# EAGLE design light (EAGLE 8.7.0)
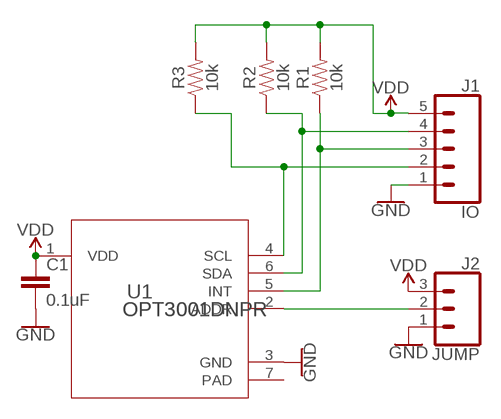
[diagram p0: schematic, sheet 1]

## Parts
C1  0.1uF  0.1UF-KIT-EZ-50V-20%  [CAP-PTH-SMALL-KIT]
J1  IO  CONN_05  [1X05]
J2  JUMP  CONN_03  [1X03]
R1  10k  10KOHM-HORIZ-1/4W-5%  [AXIAL-0.3]
R2  10k  10KOHM-HORIZ-1/4W-5%  [AXIAL-0.3]
R3  10k  10KOHM-HORIZ-1/4W-5%  [AXIAL-0.3]
U1  OPT3001DNPR  [DNP0006A]

## Nets
ADD: J2.2 U1.2(ADDR)
GND: C1.2 J1.1 J2.1 U1.3(GND)
INT: J1.3 R1.P$1 U1.5(INT)
SCL: J1.2 R3.P$1 U1.4(SCL)
SDA: J1.4 R2.P$1 U1.6(SDA)
VDD: C1.1 J1.5 J2.3 R1.P$2 R2.P$2 R3.P$2 U1.1(VDD)
Unconnected: U1.7(PAD)

## Library data of the parts
C1 = SparkFun-Capacitors:0.1UF: 0.1µF ceramic capacitors A capacitor is a passive two-terminal electrical component used to store electrical energy temporarily in an electric field.; PROD_ID: CAP-08370
J1 = SparkFun-Connectors:CONN_05: Multi connection point. Often used as Generic Header-pin footprint for 0.1 inch spaced/style header connections On any of the 0.1 inch spaced packages, you can populate with these: Break Away Headers - Straight <https://www.sparkfun.com/products/116> (PRT-00116) Break Away Male Headers - Right Angle <https://www.sparkfun.com/products/553> (PRT-00553) Female Headers <https://www.sparkfun.com/products/115> (PRT-00115) Break Away Headers - Machine Pin <https://www.sparkfun.com/products/117> (PRT-00117) Break Away Female Headers - Swiss Machine Pin <https://www.sparkfun.com/products/743> (PRT-00743) For SCREWTERMINALS and SPRING TERMINALS visit here: Screw Terimnals on SparkFun.com <https://www.sparkfun.com/search/results?term=Screw+Terminals> (5mm/3.5mm/2.54mm spacing) This device is also useful as a general connection point to wire up your design to another part of your project. Our various solder wires solder well into these plated through hole pads. Hook-Up Wire - Assortment (Stranded, 22 AWG) <https://www.sparkfun.com/products/11375> (PRT-11375) Hook-Up Wire - Assortment (Solid Core, 22 AWG) <https://www.sparkfun.com/products/11367> (PRT-11367) View the entire wire category on our website here <https://www.sparkfun.com/categories/141> Special notes: Molex polarized connector foot print use with SKU : PRT-08231 with associated crimp pins and housings. 1MM SMD Version SKU: PRT-10208
J2 = SparkFun-Connectors:CONN_03: Multi connection point. Often used as Generic Header-pin footprint for 0.1 inch spaced/style header connections On any of the 0.1 inch spaced packages, you can populate with these: Break Away Headers - Straight <https://www.sparkfun.com/products/116> (PRT-00116) Break Away Male Headers - Right Angle <https://www.sparkfun.com/products/553> (PRT-00553) Female Headers <https://www.sparkfun.com/products/115> (PRT-00115) Break Away Headers - Machine Pin <https://www.sparkfun.com/products/117> (PRT-00117) Break Away Female Headers - Swiss Machine Pin <https://www.sparkfun.com/products/743> (PRT-00743) Stackable Header - 3 Pin (Female, 0.1") <https://www.sparkfun.com/products/13875> (PRT-13875) For SCREWTERMINALS and SPRING TERMINALS visit here: Screw Terimnals on SparkFun.com <https://www.sparkfun.com/search/results?term=Screw+Terminals> (5mm/3.5mm/2.54mm spacing) This device is also useful as a general connection point to wire up your design to another part of your project. Our various solder wires solder well into these plated through hole pads. Hook-Up Wire - Assortment (Stranded, 22 AWG) <https://www.sparkfun.com/products/11375> (PRT-11375) Hook-Up Wire - Assortment (Solid Core, 22 AWG) <https://www.sparkfun.com/products/11367> (PRT-11367) View the entire wire category on our website here <https://www.sparkfun.com/categories/141> Special notes: Molex polarized connector foot print use with SKU : PRT-08232 with associated crimp pins and housings.
R1-R3 = SparkFun-Resistors:10KOHM: 10kΩ resistor A resistor is a passive two-terminal electrical component that implements electrical resistance as a circuit element. Resistors act to reduce current flow, and, at the same time, act to lower voltage levels within circuits. - Wikipedia; PROD_ID: RES-09435
U1 = OPT3001DNPT:OPT3001DNPR: OPT3001DNPT

## Board
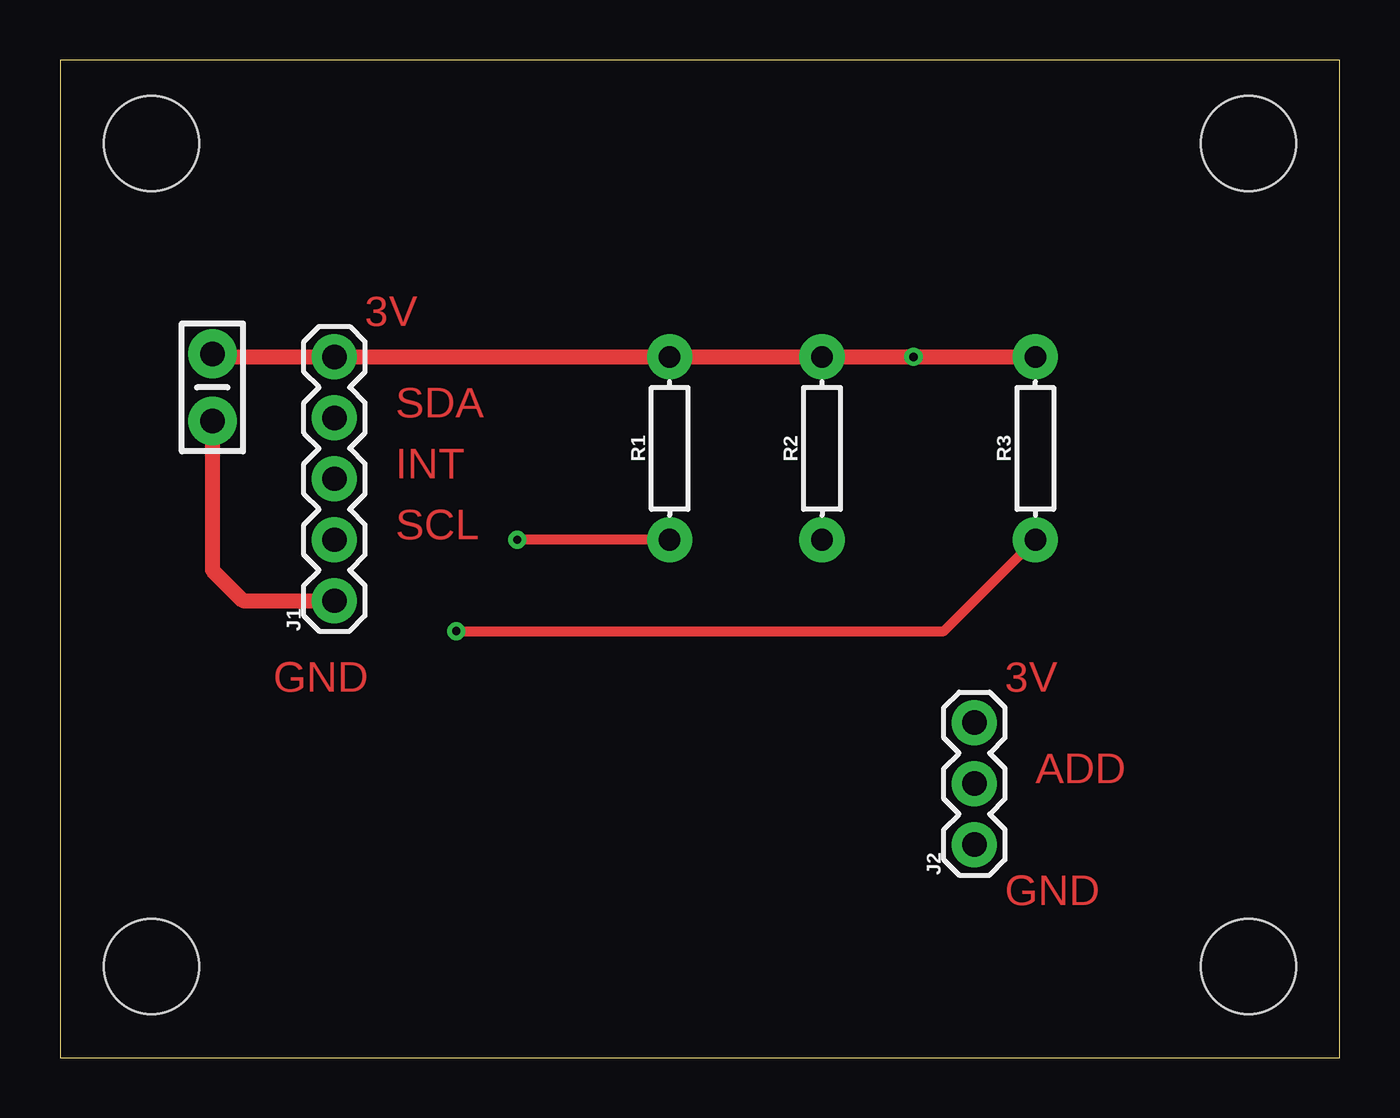
[diagram p1: board, top side]
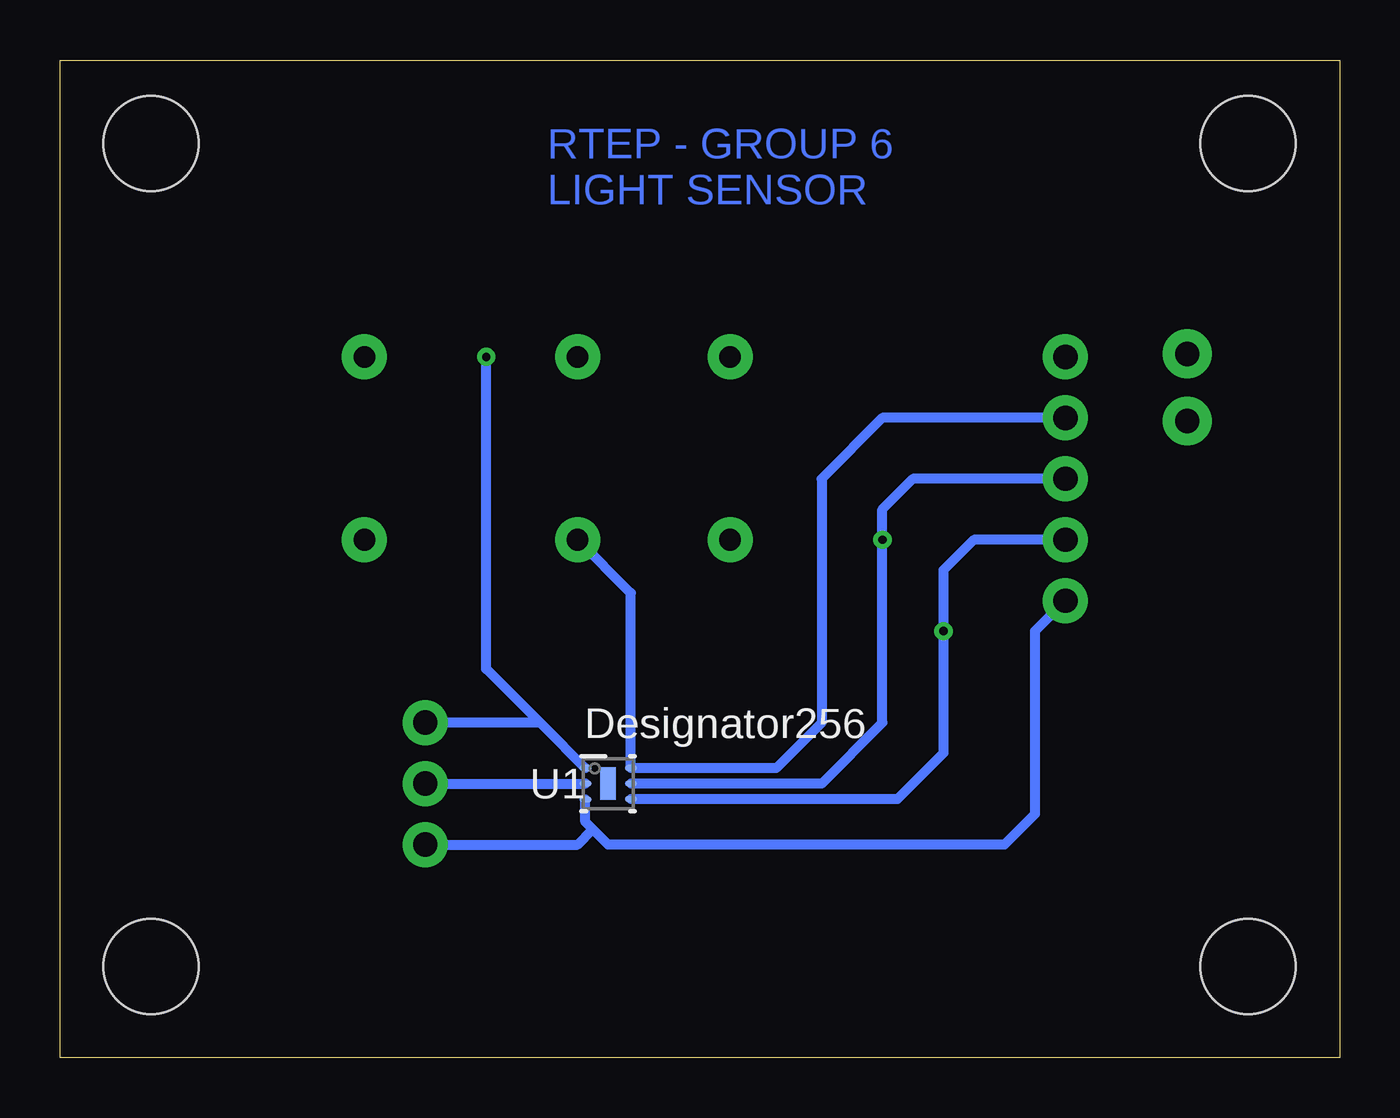
[diagram p2: board, bottom side, seen from below]

Size 53.32 x 41.58 mm. Coordinates in mm from the lower left corner, seen from the top.
Outline: 0,0 53.32,0 53.32,41.58 0,41.58 0,0
Copper layers (1*16): Top 0.035mm / dielectric 1.5mm / Bottom 0.035mm
Design rules "default *": minimum track width 6mil, minimum drill 0.35mm, track to track 6mil, track to pad 6mil, pad to pad 6mil, via to via 6mil, smd to smd 6mil, copper to edge 40mil, drill to drill 6mil, minimum pad ring 10mil, minimum via ring 8mil, stop-mask expansion 4mil, vias tented up to drill 0mil, thermal gap 10mil
Holes 3.96 mm at 3.81,38.1 49.53,38.1 49.53,3.81 3.81,3.81

### Footprints (pad centres in the part's own frame; a part is rotated, then mirrored left to right if it is on the bottom)
CAP-PTH-SMALL-KIT = drill 1.016 pad 2.032: 1 -1.397,0; 2 1.397,0
1X05 = drill 1.016 pad 1.88: 1 0,0; 2 2.54,0; 3 5.08,0; 4 7.62,0; 5 10.16,0
1X03 = drill 1.016 pad 1.88: 1 0,0; 2 2.54,0; 3 5.08,0
AXIAL-0.3 = drill 0.9 pad 1.88: P$1 -3.81,0; P$2 3.81,0
DNP0006A = smd 0.5 x 0.25: 1 -0.95,0.65; 2 -0.95,0; 3 -0.95,-0.655; 4 0.95,-0.65; 5 0.95,0; 6 0.95,0.65 | smd 0.65 x 1.35: 7 0,0

### Placement (x,y rotation side)
C1  6.35,27.94 270 top
J1  11.43,19.05 90 top
J2  38.1,8.89 90 top
R1  25.4,25.4 90 top
R2  31.75,25.4 90 top
R3  40.64,25.4 90 top
U1  30.48,11.43 0 bottom

### Tracks (layer width: path | path; a pad name or v marks a point on that pad's centre or on a via)
ADD
  Bottom 0.406: J2.2 U1.2
GND
  Top 0.635: J1.1 7.62,19.05 6.35,20.32 C1.2
  Bottom 0.406: J1.1 12.7,17.78 12.7,10.16 13.97,8.89 30.48,8.89 31.12,9.53 | 31.12,9.53 31.43,9.84 U1.3 | J2.1 31.75,8.89 31.12,9.53
INT  (via drill 0.35)
  Top 0.406: R1.P$1 v19.05,21.59
  Bottom 0.406: J1.3 17.78,24.13 19.05,22.86 v19.05,21.59 19.05,13.97 21.59,11.43 U1.5
SCL  (via drill 0.35)
  Top 0.406: v16.51,17.78 36.83,17.78 R3.P$1
  Bottom 0.406: J1.2 15.24,21.59 16.51,20.32 v16.51,17.78 16.51,12.7 18.43,10.78 U1.4
SDA
  Bottom 0.406: J1.4 19.05,26.67 21.59,24.13 21.59,13.97 23.48,12.08 U1.6 29.53,19.37 R2.P$1
VDD  (via drill 0.35)
  Top 0.635: C1.1 6.48,29.21 J1.5 R1.P$2 R2.P$2 v35.56,29.21 R3.P$2
  Bottom 0.406: v35.56,29.21 35.56,16.21 33.32,13.97 | U1.1 33.17,13.82 33.32,13.97 | 33.32,13.97 J2.3

### Text on the board
Top: 3V | SDA | INT | SCL | GND | 3V | ADD | GND
Bottom: RTEP - GROUP 6 / LIGHT SENSOR